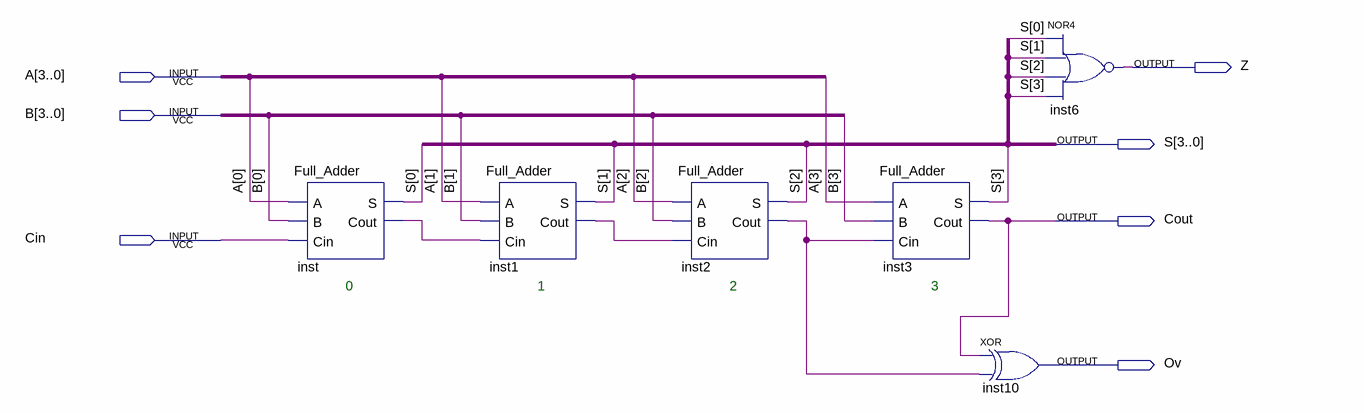
[diagram p0: schematic sheet]
// Quartus schematic Alu_4bit.bdf as structural Verilog: 6 symbols, 7 pins
module Alu_4bit (
  input  [3:0] A,
  input  [3:0] B,
  input  Cin,
  output Z,
  output [3:0] S,
  output Cout,
  output Ov
);

  wire inst1_cout, inst2_cout, inst_cout;

  Full_Adder inst (.A(A[0]), .B(B[0]), .Cin(Cin), .S(S[0]), .Cout(inst_cout));
  Full_Adder inst1 (.A(A[1]), .B(B[1]), .Cin(inst_cout), .S(S[1]), .Cout(inst1_cout));
  Full_Adder inst2 (.A(A[2]), .B(B[2]), .Cin(inst1_cout), .S(S[2]), .Cout(inst2_cout));
  Full_Adder inst3 (.A(A[3]), .B(B[3]), .Cin(inst2_cout), .S(S[3]), .Cout(Cout));
  xor inst10 (Ov, Cout, inst2_cout);
  nor inst6 (Z, S[0], S[1], S[2], S[3]);

  // Notes on the sheet:
  //   0
  //   1
  //   2
  //   3
endmodule
